# Altium schematic sheet Sheet1.SchDoc
size B
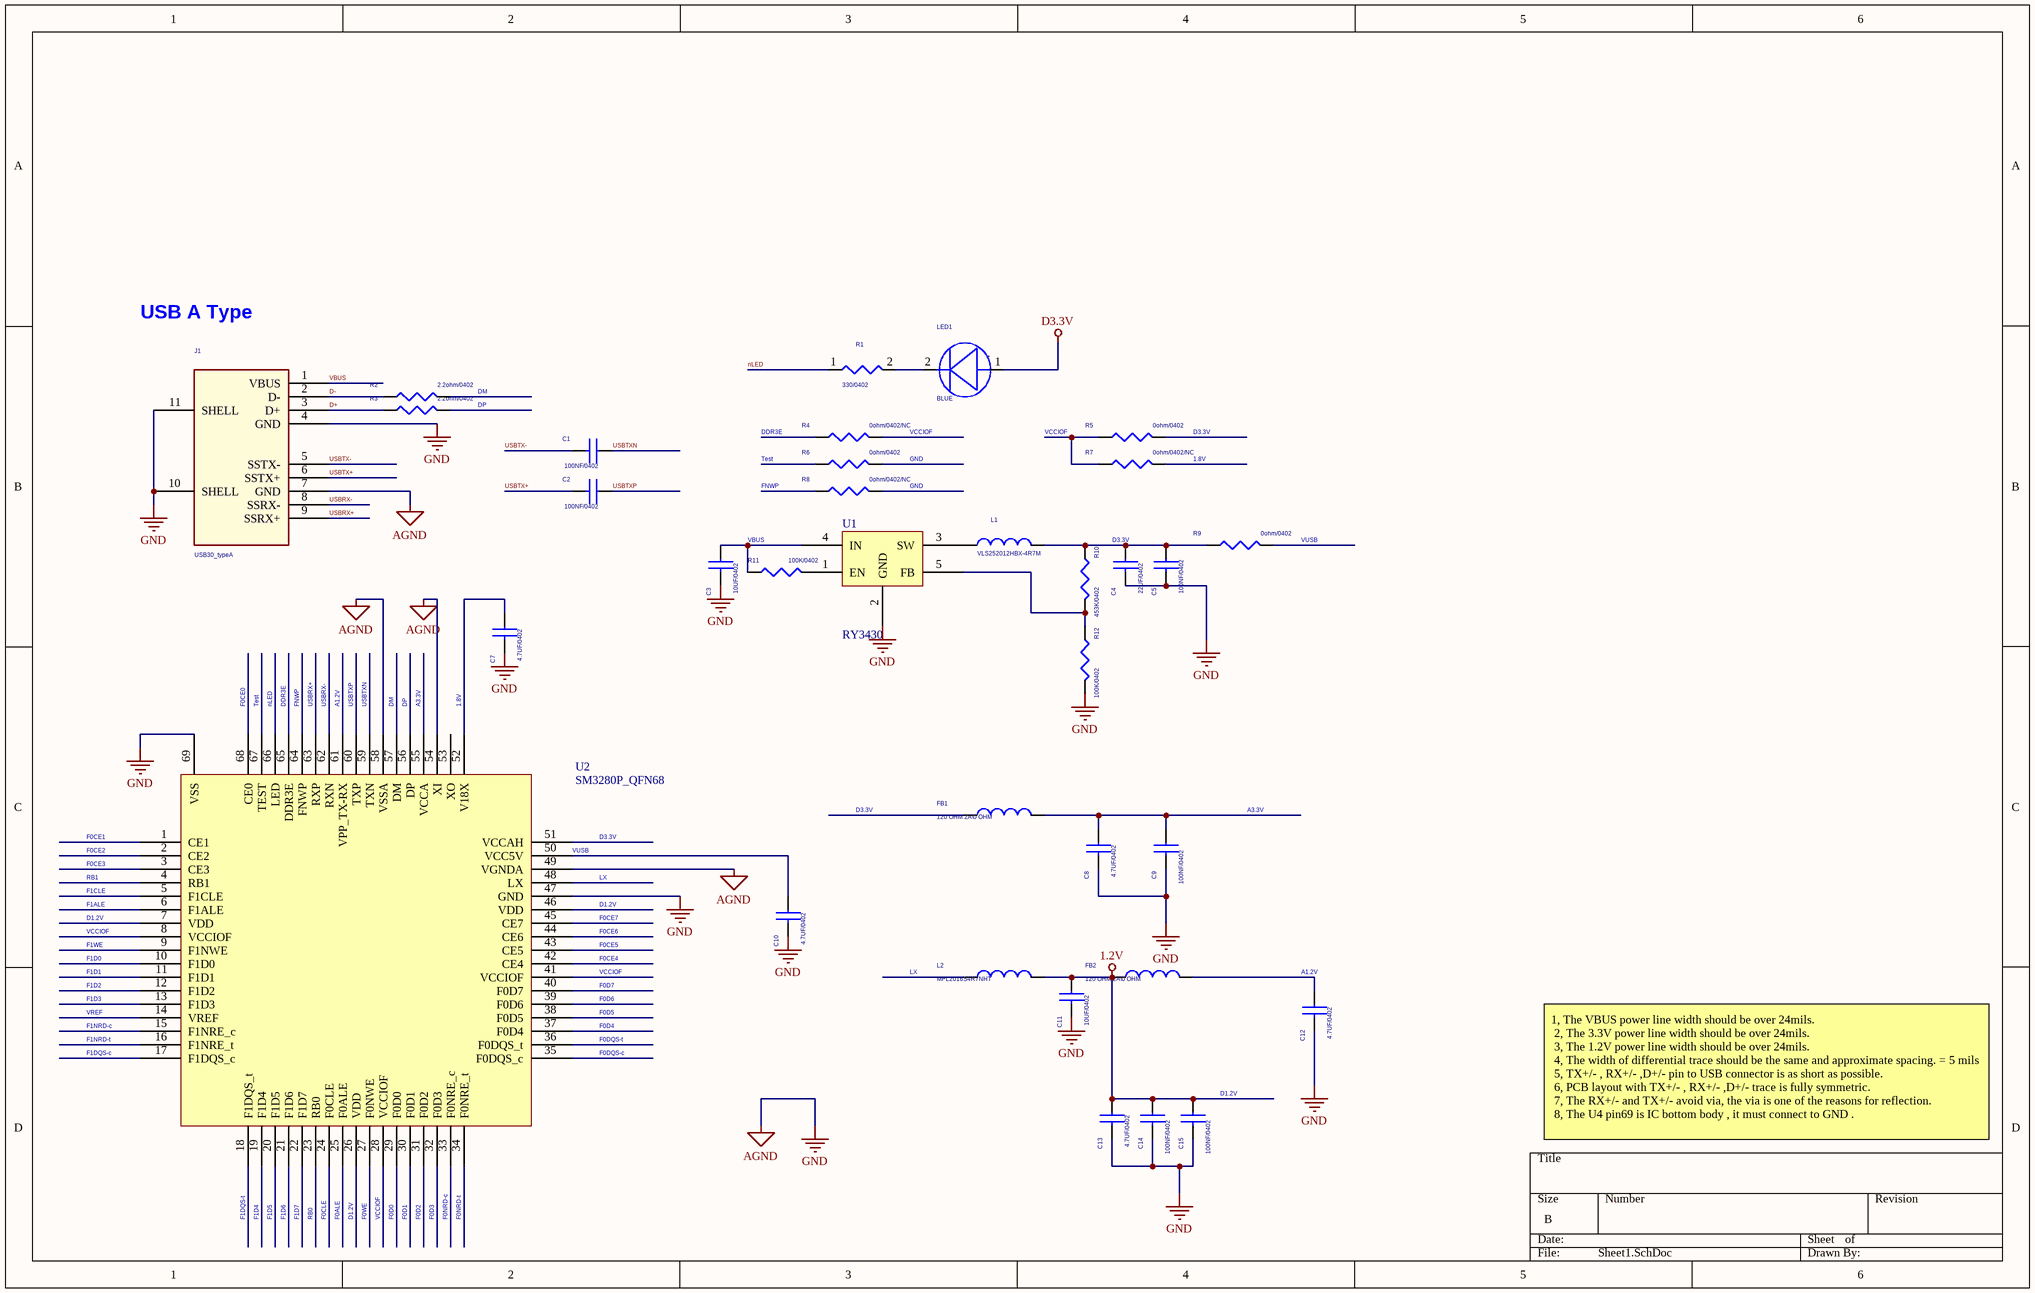
[diagram p0: Sheet1.SchDoc]

## Parts
C1  100NF/0402  [C0402]
C2  100NF/0402  [C0402]
C3  10UF/0402  [C0402]
C4  22UF/0402  [C0402]
C5  100NF/0402  [C0402]
C7  4.7UF/0402  [C0402]
C8  4.7UF/0402  [C0402]
C9  100NF/0402  [C0402]
C10  4.7UF/0402  [C0402]
C11  10UF/0402  [C0402]
C12  4.7UF/0402  [C0402]
C13  4.7UF/0402  [C0402]
C14  100NF/0402  [C0201]
C15  100NF/0402  [C0402]
FB1  120 OHM 2A\0 OHM  [SL0402]
FB2  120 OHM 2A\0 OHM  [SL0402]
J1  USB30_typeA  [USB-3.0AAAA]
L1  VLS252012HBX-4R7M  [L2520]
L2  MPL2016S4R7NHT  [L2016]
LED1  BLUE  [LED0603]
R1  330/0402  [R0402]
R2  2.2ohm/0402  [R0402]
R3  2.2ohm/0402  [R0402]
R4  0ohm/0402/NC  [R0201]
R5  0ohm/0402  [R0201]
R6  0ohm/0402  [R0201]
R7  0ohm/0402/NC  [R0201]
R8  0ohm/0402/NC  [R0201]
R9  0ohm/0402  [R0201]
R10  453K/0402  [R0402]
R11  100K/0402  [R0402]
R12  100K/0402  [R0402]
U1  RY3430
U2  SM3280P_QFN68

## Nets
D1.2V: C11.1 C13.1 C14.1 C15.1 FB2.1 L2.2 U2.7(VDD) U2.26(VDD) U2.46(VDD)  [also labelled 1.2V]
D3.3V: C4.1 C5.1 FB1.1 L1.2 LED1.1(ANODE) R5.2 R9.1 R10.1 U2.51(VCCAH)
GND: C3.2 C4.2 C5.2 C7.2 C8.2 C9.2 C10.2 C11.2 C12.2 C13.2 C14.2 C15.2 J1.4(GND) J1.7(GND) J1.10(SHELL) J1.11(SHELL) R6.2 R8.2 R12.2 U1.2(GND) U2.47(GND) U2.49(VGNDA) U2.54(XI) U2.58(VSSA) U2.69(VSS)  [also labelled AGND]
1.8V: C7.1 R7.2 U2.52(V18X)
A1.2V: C12.1 FB2.2 U2.61(VPP_TX-RX)
A3.3V: C8.1 C9.1 FB1.2 U2.55(VCCA)
D+: J1.3(D+) R3.1
D-: J1.2(D-) R2.1
DDR3E: R4.1 U2.65(DDR3E)
DM: R2.2 U2.57(DM)
DP: R3.2 U2.56(DP)
F0ALE: U2.25(F0ALE)
F0CE0: U2.68(CE0)
F0CE1: U2.1(CE1)
F0CE2: U2.2(CE2)
F0CE3: U2.3(CE3)
F0CE4: U2.42(CE4)
F0CE5: U2.43(CE5)
F0CE6: U2.44(CE6)
F0CE7: U2.45(CE7)
F0CLE: U2.24(F0CLE)
F0D0: U2.29(F0D0)
F0D1: U2.30(F0D1)
F0D2: U2.31(F0D2)
F0D3: U2.32(F0D3)
F0D4: U2.37(F0D4)
F0D5: U2.38(F0D5)
F0D6: U2.39(F0D6)
F0D7: U2.40(F0D7)
F0DQS-c: U2.35(F0DQS_c)
F0DQS-t: U2.36(F0DQS_t)
F0NRD-c: U2.33(F0NRE_c)
F0NRD-t: U2.34(F0NRE_t)
F0WE: U2.27(F0NWE)
F1ALE: U2.6(F1ALE)
F1CLE: U2.5(F1CLE)
F1D0: U2.10(F1D0)
F1D1: U2.11(F1D1)
F1D2: U2.12(F1D2)
F1D3: U2.13(F1D3)
F1D4: U2.19(F1D4)
F1D5: U2.20(F1D5)
F1D6: U2.21(F1D6)
F1D7: U2.22(F1D7)
F1DQS-c: U2.17(F1DQS_c)
F1DQS-t: U2.18(F1DQS_t)
F1NRD-c: U2.15(F1NRE_c)
F1NRD-t: U2.16(F1NRE_t)
F1WE: U2.9(F1NWE)
FNWP: R8.1 U2.64(FNWP)
LX: L2.1 U2.48(LX)
nLED: R1.1 U2.66(LED)
RB0: U2.23(RB0)
RB1: U2.4(RB1)
Test: R6.1 U2.67(TEST)
USBRX+: J1.9(SSRX+) U2.63(RXP)
USBRX-: J1.8(SSRX-) U2.62(RXN)
USBTX+: C2.2 J1.6(SSTX+)
USBTX-: C1.2 J1.5(SSTX-)
USBTXN: C1.1 U2.59(TXN)
USBTXP: C2.1 U2.60(TXP)
VBUS: C3.1 J1.1(VBUS) R11.1 U1.4(IN)
VCCIOF: R4.2 R5.1 R7.1 U2.8(VCCIOF) U2.28(VCCIOF) U2.41(VCCIOF)
VREF: U2.14(VREF)
VUSB: C10.1 R9.2 U2.50(VCC5V)
NetL1_1: L1.1 U1.3(SW)
NetLED1_2: LED1.2(CATHODE) R1.2
NetR10_2: R10.2 R12.1 U1.5(FB)

Not connected (* = marked no-connect by the designer): R11 2; U1 1(EN); U2 53(XO)

## Notes on the sheet
- USB A Type
- 1, The VBUS power line width should be over 24mils.
  2, The 3.3V power line width should be over 24mils.
  3, The 1.2V power line width should be over 24mils.
  4, The width of differential trace should be the same and approximate spacing. = 5 mils
  5, TX+/- , RX+/- ,D+/- pin to USB connector is as short as possible.
  6, PCB layout with TX+/- , RX+/- ,D+/- trace is fully symmetric.
  7, The RX+/- and TX+/- avoid via, the via is one of the reasons for reflection.
  8, The U4 pin69 is IC bottom body , it must connect to GND .
- (in symbol LED) +

## Library data of the parts
C1-C5 C7 C8 C10-C13 = C0603: CRITICAL_PART: N; MANUFACTURER: PANASONIC; MANUFACTURER_PN: ECJ1VB0J106M; PART_NUMBER: 11G10210621R; PART_TYPE: 11_C; TABLES: 11; CLASS: Passive; COMPONENT_NAME: MLCC SMD 10UF 6.3V 0603 X5R 20%; ELECTRIC_SPEC: 6.3V 0603 X5R 20%; OPTIONAL: I; TOLERANCE: 20%; CREATED_DATE: 2009/10/6; DATABASE_UPDATE: 2009/10/6; DATASHEET: N/A; PACKAGE_TYPE: SMD; QVL_APPROVE: N
C9 C14 C15 = C0402_Dup1: PART_TYPE: 11_C; PART_NUMBER: 11G101104340; MANUFACTURER_PN: 0402F104Z250CT; MANUFACTURER: WALSIN; TOLERANCE: +80/-20%; QVL_APPROVE: N; OPTIONAL: I; ELECTRIC_SPEC: 25V 0402 Y5V +80/-20%; COMPONENT_NAME: MLCC SMD 100NF 25V 0402 Y5V +80/-20%; CLASS: Passive; TABLES: 11; PACKAGE_TYPE: SMD; DATASHEET: T:\division\SD\JM_CIS_Database\05_Datasheet\11_Capacitor\Walsin_MLCC_All.pdf; DATABASE_UPDATE: 2009/10/6; CRITICAL_PART: N; CREATED_DATE: 2009/10/6
FB1 FB2 = FB0603: FB SMD 120 OHM 2A 0402; Part_Type: 09_Inductor; Part Number: 09G102000160; Manufacturer_PN: BLM18PG121SN1D; Manufacturer: MURATA; QVL_Approve: N; Optional: I; Electric_Spec: 120 OHM 2A 0603; Component_Name: FB SMD 120 OHM 2A 0603; Class: Discrete; Tolerance: N/A; Package Type: SMD; Datasheet: T:\division\SD\JM_CIS_Database\05_Datasheet\09_Inductor\09G102000160.pdf; Critical_Part: N
J1 = USB30 connector_0
L1 = GNR2512PA-1R0M_0: CRITICAL_PART: N; MANUFACTURER: GOTREND; PART_NUMBER: 09G1502034A0; PART_TYPE: 09_Inductor; TABLES: 09; COMPONENT_NAME: CHOKE SMD 1.0UH/3.45A(MAX) +/-20% GNR2512PA-1R0M; ELECTRIC_SPEC: 1.0UH/3.45A(MAX); OPTIONAL: I; TOLERANCE: +/-20%; CREATED_DATE: 2015/11/6; DATABASE_UPDATE: 2015/11/6; DATASHEET: T:\division\Division_Share\JM_CIS_Database\05_Datasheet\09_Inductor\09G1502034A0.pdf; MANUFACTURER_PN: GNR2512PA-1R0M; PACKAGE_TYPE: SMD; QVL_APPROVE: N
L2 = FB0603: Part_Type: 09_Inductor; Part Number: 09G102000160; Manufacturer_PN: BLM18PG121SN1D; Manufacturer: MURATA; QVL_Approve: N; Optional: I; Electric_Spec: 120 OHM 2A 0603; Component_Name: FB SMD 120 OHM 2A 0603; Class: Discrete; Tolerance: N/A; Package Type: SMD; Datasheet: T:\division\SD\JM_CIS_Database\05_Datasheet\09_Inductor\09G102000160.pdf; Critical_Part: N
LED1 = LED: Part Number: 07G015200206; Manufacture: LITEON; Critical_Part: N; Component_Name: LED BLUE (0603) SMD; Electric_SPE: If=5mA/3V; Sourcer: 綠▅篴(X15454); Data_Sheet: K:\DataSheet\07-DISCRETE\07G015200206.pdf; Device: led_2p_63x31_h16; Class: DISCRETE; metal_fabrication: 00000011; Package_Type: SMD; Part Type: 07DISCRETE\LED; Database_Update: 2007/3/3; Modify_Data: 2005/8/10; Optional: N/A; Subsystem_ID: N/A; Colay_Group: N/A; Colay_Alternate: N/A
R1 = R_Dup1: Critical_Part: N; Manufacture: TA-I; Part Number: 10G212102004010; metal_fabrication: 0000001U; Class: DISCRETE; Data_Sheet: J:\DataSheet\10-RESISTOR\10G212102004010.zip; Tolerance: 5%; Electric_SPE: 1/16W; Component_Name: RES 1K OHM 1/16W(0402) 5%; Colay_Alternate: N/A; Colay_Group: N/A; Subsystem_ID: N/A; Optional: N/A; Modify_Data: 2005/2/25; Database_Update: 2009/9/12; Part Type: 10RESISTOR\RESISTOR; Device: r0402; Package_Type: SMD; Symbol_Preview: http://tp-caevm-01/ET_Test/FpPre.aspx?PN=10G212102004010&LIB=COM; Status: All某纔舦5
R2-R9 = R
R10-R12 = R0402: CRITICAL_PART: N; MANUFACTURER: WALSIN; MANUFACTURER_PN: WR04X104JTL; PART_NUMBER: 10G101010410; PART_TYPE: 10_R; TABLES: 10; CLASS: Passive; COMPONENT_NAME: RES SMD 100K OHM 1/16W 0402 5%; ELECTRIC_SPEC: 1/16W 0402 5%; OPTIONAL: I; TOLERANCE: 5%; CREATED_DATE: 2009/10/6; DATABASE_UPDATE: 2009/10/6; DATASHEET: T:\division\SD\JM_CIS_Database\05_Datasheet\10_Resistor\WALSIN_R_All_2009.pdf; PACKAGE_TYPE: SMD; QVL_APPROVE: N